# Altium schematic sheet power_supply.SchDoc
size A; SheetNumber: 4; SheetTotal: 4
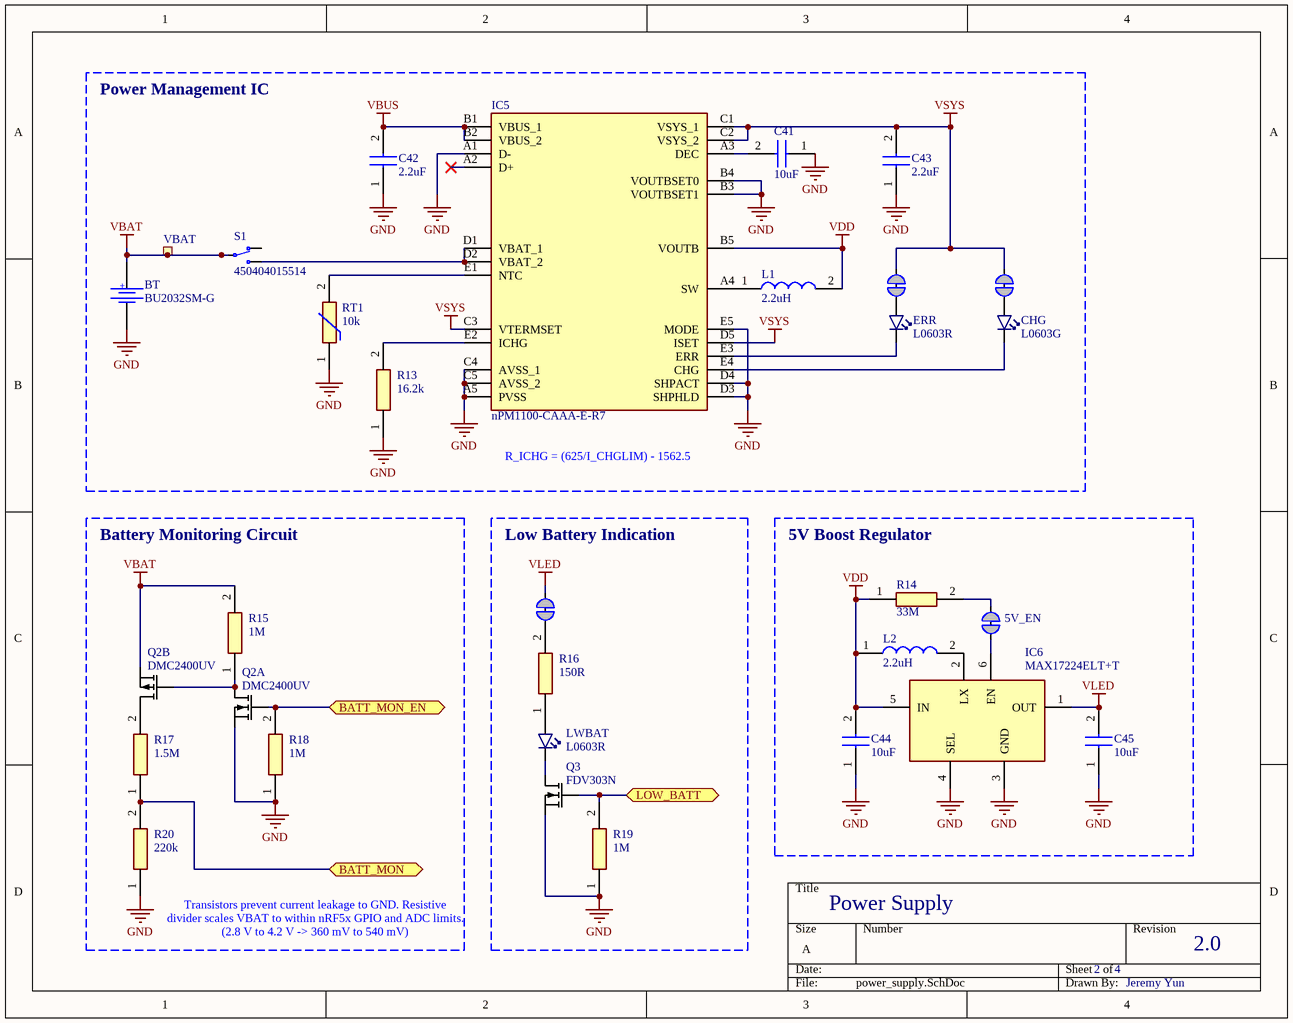
[diagram p0: power_supply.SchDoc]

## Parts
5V_EN  Solderbridge  [Solderbridge_Shorted]  (value not drawn)  (net tie, no BOM)
BT  BU2032SM-G  [BAT_BU2032SM-G]
C41  10uF  [CAPC1005X55N]
C42  2.2uF  [CAPC0603X33N]
C43  2.2uF  [CAPC0603X33N]
C44  10uF  [CAPC1005X55N]
C45  10uF  [CAPC1005X55N]
CHG  L0603G  [LED_0603_G]
ERR  L0603R  [LEDC1608X80N]
IC5  nPM1100-CAAA-E-R7  [BGA25C40P5X5_208X208X52]
IC6  MAX17224ELT+T  [MAX17224ELTT]
L1  2.2uH  [DFE201210S1R0MP2]
L2  2.2uH  [LQM2HPZ3R3MJ0B]
LWBAT  L0603R  [LEDC1608X80N]
Q2  DMC2400UV  [SOTFL50P162X60-6N]  (parts A,B of 2)
Q3  FDV303N  [SOT96P237X111-3N]
R13  16.2k  [RESC1608X55N]
R14  33M  [RESC1005X40N]
R15  1M  [RESC1608X55N]
R16  150R  [ERJ2RKD1004X]
R17  1.5M  [ERJ2RKD1004X]
R18  1M  [RESC1608X55N]
R19  1M  [RESC1608X55N]
R20  220k  [ERJ2RKD1004X]
RT1  10k  [ERTJZEG103FA]
S1  450404015514  [450404015514]
SB9  Solderbridge  [Solderbridge_Shorted]  (value not drawn)  (net tie, no BOM)
SB10  Solderbridge  [Solderbridge_Shorted]  (value not drawn)  (net tie, no BOM)
SB15  Solderbridge  [Solderbridge_Shorted]  (value not drawn)  (net tie, no BOM)
VBAT  Ø1.0mm,SMD  [TP_SMD_D1.0mm]  (value not drawn)  (no BOM)

## Blocks framed on the sheet
Power Management IC: BT C41-C43 CHG ERR IC5 L1 R13 RT1 S1 SB9 SB10 VBAT
Battery Monitoring Circuit: Q2 R15 R17 R18 R20
Low Battery Indication: LWBAT Q3 R16 R19 SB15
5V Boost Regulator: 5V_EN C44 C45 IC6 L2 R14

## Ports
BATT_MON (bidir), BATT_MON_EN (bidir), LOW_BATT (bidir)

## Nets
GND: BT.NEG C41.1 C42.1 C43.1 C44.1 C45.1 IC5.A1(D-) IC5.A5(PVSS) IC5.B3(VOUTBSET1) IC5.B4(VOUTBSET0) IC5.C4(AVSS_1) IC5.C5(AVSS_2) IC5.D3(SHPHLD) IC5.D4(SHPACT) IC5.E5(MODE) IC6.3(GND) IC6.4(SEL) Q2.1(S1) Q3.2(S) R13.1 R18.1 R19.1 R20.1 RT1.1
VBAT: BT.POS Q2.4(S2) R15.2 S1.2(COM-1) VBAT.1
VBUS: C42.2 IC5.B1(VBUS_1) IC5.B2(VBUS_2)
VDD: C44.2 IC5.B5(VOUTB) IC6.5(IN) L1.2 L2.1 R14.1
VLED: C45.2 IC6.1(OUT) SB15.2
VSYS: C43.2 IC5.C1(VSYS_1) IC5.C2(VSYS_2) IC5.C3(VTERMSET) IC5.D5(ISET) SB9.2 SB10.2
BATT_MON: R17.1 R20.2 ; port BATT_MON
BATT_MON_EN: Q2.2(G1) R18.2 ; port BATT_MON_EN
LOW_BATT: Q3.1(G) R19.2 ; port LOW_BATT
Net5V_EN_1: 5V_EN.1 IC6.6(EN)
Net5V_EN_2: 5V_EN.2 R14.2
NetC41_2: C41.2 IC5.A3(DEC)
NetCHG_1: CHG.1(C) IC5.E4(CHG)
NetCHG_2: CHG.2(A) SB10.1
NetERR_1: ERR.1(C) IC5.E3(ERR)
NetERR_2: ERR.2(A) SB9.1
NetIC5_A4: IC5.A4(SW) L1.1
NetIC5_D1: IC5.D1(VBAT_1) IC5.D2(VBAT_2) S1.1(N.O-1)
NetIC5_E1: IC5.E1(NTC) RT1.2
NetIC5_E2: IC5.E2(ICHG) R13.2
NetIC6_2: IC6.2(LX) L2.2
NetLWBAT_1: LWBAT.1(C) Q3.3(D)
NetLWBAT_2: LWBAT.2(A) R16.1
NetQ2_3: Q2.3(D2) R17.2
NetQ2_5: Q2.5(G2) Q2.6(D1) R15.1
NetR16_2: R16.2 SB15.1

Not connected (* = marked no-connect by the designer): IC5 A2(D+)*; S1 3(N.C-1)

## Notes on the sheet
- R_ICHG = (625/I_CHGLIM) - 1562.5
- Power Supply
- (near R20) Transistors prevent current leakage to GND. Resistive divider scales VBAT to within nRF5x GPIO and ADC limits. (2.8 V to 4.2 V -> 360 mV to 540 mV)
- 2
- 4
- 2.0
- Jeremy Yun
- (in symbol BU2032SM-G) +

## Library data of the parts
5V_EN SB9 SB10 SB15 = Solderbridge Shorted: Shorted Solderbridge; Manufacturer: N.A.; Pad Count: 2; Part Number: Solderbridge Shorted; Manufacturer Part Number: N.A.; LatestRevisionDate: 2012-08-07; Pin Count: 2; Publisher: Nordic Semiconductor; Published: 2012-08-07; Value: Solderbridge; Note: N.A.; Artikkelnr Noca: N.A.; Footprint Doc: Solderbridge_Shorted; Part number IPS: N.A.; ComponentLink1URL: N.A.; ComponentLink1Description: Datasheet; ComponentLink2URL: N.A.; ComponentLink2Description: Supplier link; HelpURL: N.A.; Supplier 1: N.A.; Supplier Part Number 1: N.A.; Supplier 2: N.A.; Supplier Part Number 2: N.A.; Author: rsk; Component Class: Connectors; PartId: 100500459; Part number Norautron: N.A.
BT = BU2032SM-G: BATTERY HOLDER COIN 20MM SMD; MF: MPD; MP: BU2032SM-G; Package: None; Availability: Unavailable; Price: None; SnapEDA_Link: https://www.snapeda.com/parts/BU2032SM-G/Memory%20Protection%20Devices/view-part/4219599/?ref=snap; Value: *
C41 C44 C45 = GRM155R60J106ME05D: Capacitor 10uF X5R Ceramic; Manufacturer_Name: Murata Electronics; Datasheet Link: http://www.murata.com/~/media/webrenewal/support/library/catalog/products/capacitor/mlcc/c02e.pdf; Height: 0.55mm; Manufacturer_Part_Number: GRM155R60J106ME05D; Mouser Part Number: 81-GRM155R60J106M05D; Mouser Price/Stock: https://www.mouser.co.uk/ProductDetail/Murata-Electronics/GRM155R60J106ME05D?qs=d0WKAl%252BL4KYEzZPQ8Lkwdw%3D%3D; Arrow Part Number: GRM155R60J106ME05D; Arrow Price/Stock: https://www.arrow.com/en/products/grm155r60j106me05d/murata-manufacturing?region=nac
C42 C43 = GRM033R60J225ME47D: Capacitor; Manufacturer_Name: Murata Electronics; Datasheet Link: http://www.murata.com/~/media/webrenewal/support/library/catalog/products/capacitor/mlcc/c02e.pdf; Height: 0.33mm; Manufacturer_Part_Number: GRM033R60J225ME47D; Mouser Part Number: 81-GRM033R60J225ME7D; Mouser Price/Stock: https://www.mouser.co.uk/ProductDetail/Murata-Electronics/GRM033R60J225ME47D?qs=kRS0rR9cfpW%252Btpdb3iqxoA%3D%3D; Arrow Part Number: GRM033R60J225ME47D; Arrow Price/Stock: https://www.arrow.com/en/products/grm033r60j225me47d/murata-manufacturing
CHG = VS 25C7M5: LED, Green, 0603, 573nm, Vf=2.0V, 24mcd, - 40 to +85°C; Manufacturer: Victory Electronics; Part number IPS: 00000001274, 00000009961; Note: N.A.; Artikkelnr Noca: 13019193; Pad Count: 2; Part Number: VS 25C7M5; Manufacturer Part Number: VS 25C7M5; Footprint Doc: 0603; LatestRevisionDate: 2020-10-23; Published: 2017-08-21; Value: L0603G; ComponentLink1URL: N.A.; ComponentLink1Description: Datasheet; ComponentLink2URL: N.A.; ComponentLink2Description: Supplier link; HelpURL: \\hizz\pro\app9717\Datasheet\optoelectronics\Victory Electronics\VS 25C7M5.pdf; Supplier 1: EC Partner; Supplier Part Number 1: N.A.; Supplier 2: N.A.; Supplier Part Number 2: N.A.; PartId: 101400097; Component Class: Optoelectronics; Author: rsk; Part number Norautron: N.A.
ERR LWBAT = LS_Q976-NR-1: LED; Manufacturer_Name: ams OSRAM; Manufacturer_Part_Number: LS Q976-NR-1; Datasheet Link: https://datasheet.datasheetarchive.com/originals/distributors/DKDS41/DSANUWW0036602.pdf; Height: 0.8mm; Mouser Part Number: 720-LSQ976-NR-1; Mouser Price/Stock: https://www.mouser.co.uk/ProductDetail/ams-OSRAM/LS-Q976-NR-1?qs=K5ta8V%252BWhtbwdFgXKu1Oiw%3D%3D; Arrow Part Number: LS Q976-NR-1; Arrow Price/Stock: https://www.arrow.com/en/products/lsq976-nr-1/osram-opto-semiconductors?region=europe
IC5 = nPM1100-CAAA-E-R7: Integrated Circuit; Manufacturer_Name: Nordic Semiconductor; Datasheet Link: https://eu.mouser.com/datasheet/2/297/nPM1100_PS_v1_1-3074770.pdf; Height: 0.522mm; Manufacturer_Part_Number: nPM1100-CAAA-E-R7; Mouser Part Number: 949-NPM1100-CAAA-R7; Mouser Price/Stock: https://www.mouser.co.uk/ProductDetail/Nordic-Semiconductor/nPM1100-CAAA-E-R7?qs=vvQtp7zwQdOU6PwQjneJOA%3D%3D; Arrow Part Number: NPM1100-CAAA-E-R7; Arrow Price/Stock: https://www.arrow.com/en/products/npm1100-caaa-e-r7/nordic-semiconductor?region=nac
IC6 = MAX17224ELT+T: Integrated Circuit; Manufacturer_Name: Analog Devices; Datasheet Link: https://www.analog.com/MAX17224/datasheet; Height: 0.8mm; Manufacturer_Part_Number: MAX17224ELT+T; Mouser Part Number: 700-MAX17224ELT+T; Mouser Price/Stock: https://www.mouser.co.uk/ProductDetail/Maxim-Integrated/MAX17224ELT%2bT?qs=BZBei1rCqCCCW5323eMGwQ%3D%3D; Arrow Part Number: MAX17224ELT+T; Arrow Price/Stock: https://www.arrow.com/en/products/max17224eltt/maxim-integrated?region=nac
L1 = DFE201210U-2R2M=P2: Inductor; Manufacturer_Name: Murata Electronics; Datasheet Link: https://psearch.en.murata.com/inductor/product/DFE201210U-2R2M%23.html; Height: 1mm; Manufacturer_Part_Number: DFE201210U-2R2M=P2; Mouser Part Number: 81-DFE201210U-2R2MP2; Mouser Price/Stock: https://www.mouser.co.uk/ProductDetail/Murata-Electronics/DFE201210U-2R2M%3dP2?qs=AQlKX63v8Rt%252B2GxwUyA5Fw%3D%3D; Arrow Part Number: DFE201210U-2R2M=P2; Arrow Price/Stock: https://www.arrow.com/en/products/dfe201210u-2r2mp2/murata-manufacturing?region=nac
L2 = LQM2HPN2R2MJ0L: Inductor; Manufacturer_Name: Murata Electronics; Datasheet Link: https://psearch.en.murata.com/inductor/product/LQM2HPN2R2MJ0%23.html; Height: 1.2mm; Manufacturer_Part_Number: LQM2HPN2R2MJ0L; Mouser Part Number: 81-LQM2HPN2R2MJ0L; Mouser Price/Stock: https://www.mouser.co.uk/ProductDetail/Murata-Electronics/LQM2HPN2R2MJ0L?qs=%2F%252BYoplLUB5gah%2Fy6io9rJg%3D%3D; Arrow Part Number: LQM2HPN2R2MJ0L; Arrow Price/Stock: https://www.arrow.com/en/products/lqm2hpn2r2mj0l/murata-manufacturing?region=nac
Q2 = DMC2400UV: Transistor; Manufacturer_Name: Diodes Incorporated; Datasheet Link: https://www.diodes.com/assets/Datasheets/DMC2400UV.pdf; Height: 0.6mm; Manufacturer_Part_Number: DMC2400UV; Mouser Part Number: N/A; Mouser Price/Stock: https://www.mouser.co.uk/ProductDetail/Diodes-Incorporated/DMC2400UV?qs=Wj%2FVkw3K%252BMA7RIsKQCzONw%3D%3D
Q3 = FDV303N: MOSFET (N-Channel); Manufacturer_Name: onsemi; Datasheet Link: https://www.onsemi.com/pub/Collateral/FDV303N-D.PDF; Height: 1.11mm; Manufacturer_Part_Number: FDV303N; Mouser Part Number: 512-FDV303N; Mouser Price/Stock: https://www.mouser.co.uk/ProductDetail/onsemi-Fairchild/FDV303N?qs=FOlmdCx%252BAA1IyXspysHTkA%3D%3D; Arrow Part Number: FDV303N; Arrow Price/Stock: https://www.arrow.com/en/products/fdv303n/on-semiconductor?region=europe
R13 = RC0603FR-0716K2L: Resistor; Manufacturer_Name: KEMET; Datasheet Link: http://www.yageo.com/documents/recent/PYu-RC0603_51_RoHS_L_v5.pdf; Height: 0.55mm; Manufacturer_Part_Number: RC0603FR-0716K2L; Mouser Part Number: 603-RC0603FR-0716K2L; Mouser Price/Stock: https://www.mouser.co.uk/ProductDetail/Yageo/RC0603FR-0716K2L?qs=VU8sRB4EgwBbyU4POY2x9w%3D%3D
R14 = HMC0402JT33M0: Resistor; Manufacturer_Name: Stackpole Electronics; Datasheet Link: https://cs.seielect.com/catalog/SEI-HMC.pdf; Height: 0.4mm; Manufacturer_Part_Number: HMC0402JT33M0; Arrow Part Number: HMC0402JT33M0; Arrow Price/Stock: https://www.arrow.com/en/products/hmc0402jt33m0/stackpole-electronics
R15 R18 R19 = ERJ-3EKF1004V: Resistor; Manufacturer_Name: Panasonic; Datasheet Link: http://industrial.panasonic.com/cdbs/www-data/pdf/RDA0000/AOA0000C86.pdf; Height: 0.55mm; Manufacturer_Part_Number: ERJ-3EKF1004V; Mouser Part Number: 667-ERJ-3EKF1004V; Mouser Price/Stock: https://www.mouser.co.uk/ProductDetail/Panasonic/ERJ-3EKF1004V?qs=6%252BUraArZVSCwybhfQn7iYg%3D%3D; Arrow Part Number: ERJ-3EKF1004V; Arrow Price/Stock: https://www.arrow.com/en/products/erj-3ekf1004v/panasonic?region=nac
R16 = ERJ-2RKF1500X: Resistor; Manufacturer_Name: Panasonic; Datasheet Link: https://industrial.panasonic.com/cdbs/www-data/pdf/RDA0000/AOA0000C86.pdf; Height: 0.4mm; Manufacturer_Part_Number: ERJ-2RKF1500X; Mouser Part Number: 667-ERJ-2RKF1500X; Mouser Price/Stock: https://www.mouser.co.uk/ProductDetail/Panasonic/ERJ-2RKF1500X?qs=MVjVSMjNRMocymBqQ7AAtQ%3D%3D; Arrow Part Number: ERJ-2RKF1500X; Arrow Price/Stock: https://www.arrow.com/en/products/erj-2rkf1500x/panasonic?region=nac
R17 = ERJ-2GEJ155X: Resistor; Manufacturer_Name: Panasonic; Datasheet Link: https://datasheet.datasheetarchive.com/originals/distributors/DKDS40/DSANUWW0010593.pdf; Height: 0.4mm; Manufacturer_Part_Number: ERJ-2GEJ155X; Mouser Part Number: 667-ERJ-2GEJ155X; Mouser Price/Stock: https://www.mouser.co.uk/ProductDetail/Panasonic/ERJ-2GEJ155X?qs=MVjVSMjNRMoBrgcCxtyHNA%3D%3D
R20 = ERJ-2GEJ224X: Resistor; Manufacturer_Name: Panasonic; Datasheet Link: https://datasheet.datasheetarchive.com/originals/distributors/DKDS40/DSANUWW0010623.pdf; Height: 0.4mm; Manufacturer_Part_Number: ERJ-2GEJ224X; Mouser Part Number: 667-ERJ-2GEJ224X; Mouser Price/Stock: https://www.mouser.co.uk/ProductDetail/Panasonic/ERJ-2GEJ224X?qs=H7k1u0Mp9JQ0o1uy9bJkFg%3D%3D; Arrow Part Number: ERJ-2GEJ224X; Arrow Price/Stock: https://www.arrow.com/en/products/erj2gej224x/panasonic?region=nac
RT1 = ERT-JZEG103FA: NTC Thermistor 10k 0201 (0603 Metric); Manufacturer_Name: Panasonic; Datasheet Link: https://industrial.panasonic.com/cdbs/www-data/pdf/AUA0000/AUA0000C8.pdf; Height: 0.33mm; Manufacturer_Part_Number: ERT-JZEG103FA; Mouser Part Number: 667-ERT-JZEG103FA; Mouser Price/Stock: https://www.mouser.co.uk/ProductDetail/Panasonic/ERT-JZEG103FA?qs=8rMlxy%252BA7jnazXT5AW8efg%3D%3D; Arrow Part Number: ERT-JZEG103FA; Arrow Price/Stock: https://www.arrow.com/en/products/ert-jzeg103fa/panasonic?region=nac
S1 = 450404015514: Switch; Manufacturer_Name: Wurth Elektronik; Datasheet Link: https://katalog.we-online.de/em/datasheet/450404015514.pdf; Height: 1.4mm; Manufacturer_Part_Number: 450404015514; Mouser Part Number: 710-450404015514; Mouser Price/Stock: https://www.mouser.co.uk/ProductDetail/Wurth-Elektronik/450404015514?qs=sPbYRqrBIVk21%2FxsES2IZA%3D%3D
VBAT = TP_SMD_Ø1.0MM: 1.0mm circular SMD testpad; Manufacturer: Nordic Semiconductor; Manufacturer Part Number: N.A.; Pad Count: 1; Part Number: TP_SMD_Ø1.0MM; LatestRevisionDate: 2021-03-05; Pin Count: 1; Publisher: Nordic Semiconductor; Published: 2013-06-11; Value: Ø1.0mm,SMD; Note: N.A.; Artikkelnr Noca: N.A.; Footprint Doc: TP_SMD_Ø1.0mm; Part number IPS: N.A.; ComponentLink1URL: N.A.; ComponentLink1Description: Datasheet; ComponentLink2URL: N.A.; ComponentLink2Description: Supplier link; HelpURL: N.A.; Supplier 1: N.A.; Supplier Part Number 1: N.A.; Supplier 2: N.A.; Supplier Part Number 2: N.A.; Author: rsk; Component Class: Connectors; PartId: 100500475; Part number Norautron: N.A.